# EAGLE design motor-driver (EAGLE 9.6.2)
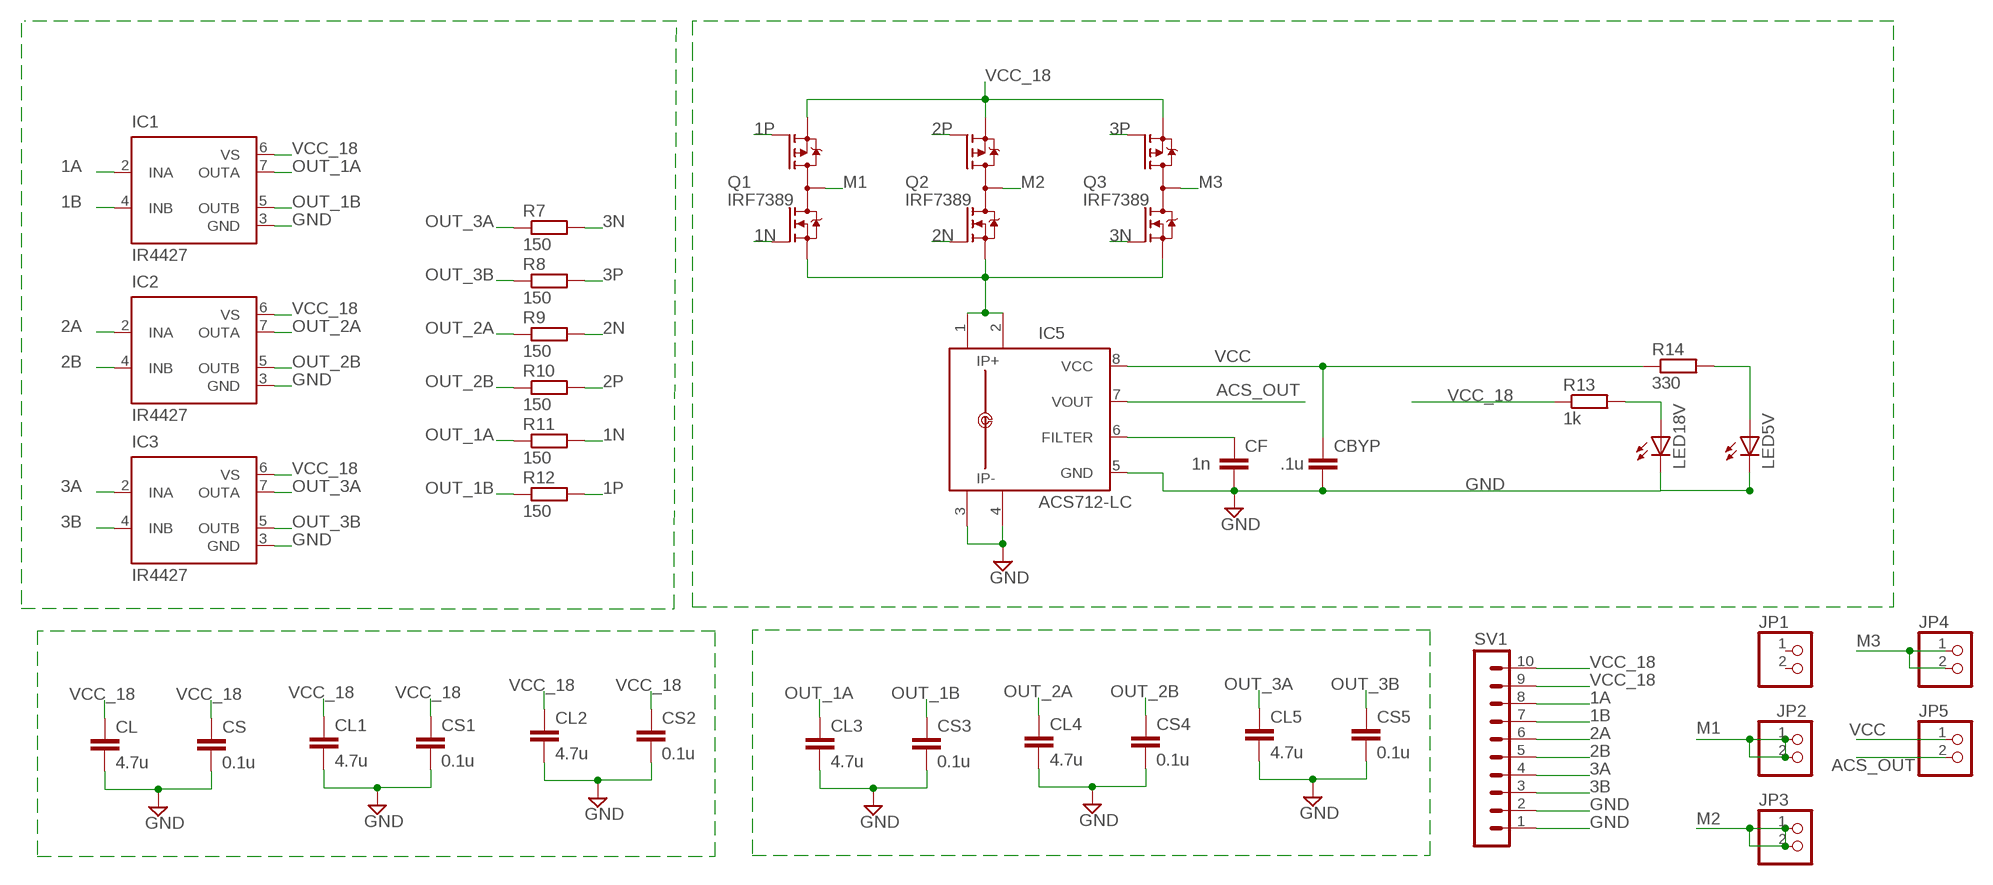
[diagram p0: schematic, sheet 1]

## Parts
CBYP  .1u  CC1206  [C1206]
CF  1n  CC1206  [C1206]
CL  4.7u  CC1206  [C1206]
CL1  4.7u  CC1206  [C1206]
CL2  4.7u  CC1206  [C1206]
CL3  4.7u  CC1206  [C1206]
CL4  4.7u  CC1206  [C1206]
CL5  4.7u  CC1206  [C1206]
CS  0.1u  CC1206  [C1206]
CS1  0.1u  CC1206  [C1206]
CS2  0.1u  CC1206  [C1206]
CS3  0.1u  CC1206  [C1206]
CS4  0.1u  CC1206  [C1206]
CS5  0.1u  CC1206  [C1206]
IC1  IR4427  [DIL08]
IC2  IR4427  [DIL08]
IC3  IR4427  [DIL08]
IC5  ACS712-LC  [SOIC8]
JP1  PINHD-1X2  [1X02]
JP2  PINHD-1X2  [1X02]
JP3  PINHD-1X2  [1X02]
JP4  PINHD-1X2  [1X02]
JP5  PINHD-1X2  [1X02]
LED5V  LEDCHIPLED_1206  [CHIPLED_1206]
LED18V  LEDCHIPLED_1206  [CHIPLED_1206]
Q1  IRF7389  [SO08-IRF]
Q2  IRF7389  [SO08-IRF]
Q3  IRF7389  [SO08-IRF]
R7  150  RR1206  [R1206]
R8  150  RR1206  [R1206]
R9  150  RR1206  [R1206]
R10  150  RR1206  [R1206]
R11  150  RR1206  [R1206]
R12  150  RR1206  [R1206]
R13  1k  RR1206  [R1206]
R14  330  RR1206  [R1206]
SV1  MA10-1  [MA10-1]

## Nets
1A: IC1.2(INA) SV1.8
1B: IC1.4(INB) SV1.7
1N: Q1.2(N-G) R11.2
1P: Q1.4(P-G) R12.2
2A: IC2.2(INA) SV1.6
2B: IC2.4(INB) SV1.5
2N: Q2.2(N-G) R9.2
2P: Q2.4(P-G) R10.2
3A: IC3.2(INA) SV1.4
3B: IC3.4(INB) SV1.3
3N: Q3.2(N-G) R7.2
3P: Q3.4(P-G) R8.2
ACS_OUT: IC5.7(VOUT) JP5.2
FILTER_ACS: CF.1 IC5.6(FILTER)
GND: CBYP.2 CF.2 CL1.2 CL2.2 CL3.2 CL4.2 CL5.2 CL.2 CS1.2 CS2.2 CS3.2 CS4.2 CS5.2 CS.2 IC1.3(GND) IC2.3(GND) IC3.3(GND) IC5.3(IP-) IC5.4(IP-1) IC5.5(GND) LED5V.C LED18V.C SV1.1 SV1.2
M1: JP2.1 JP2.2 Q1.5(D) Q1.6(D) Q1.7(D) Q1.8(D)
M2: JP3.1 JP3.2 Q2.5(D) Q2.6(D) Q2.7(D) Q2.8(D)
M3: JP4.1 JP4.2 Q3.5(D) Q3.6(D) Q3.7(D) Q3.8(D)
N$2: LED18V.A R13.2
N$4: LED5V.A R14.2
OUT_1A: CL3.1 IC1.7(OUTA) R11.1
OUT_1B: CS3.1 IC1.5(OUTB) R12.1
OUT_2A: CL4.1 IC2.7(OUTA) R9.1
OUT_2B: CS4.1 IC2.5(OUTB) R10.1
OUT_3A: CL5.1 IC3.7(OUTA) R7.1
OUT_3B: CS5.1 IC3.5(OUTB) R8.1
SINK: IC5.1(IP+) IC5.2(IP+1) Q1.1(N-S) Q2.1(N-S) Q3.1(N-S)
VCC: CBYP.1 IC5.8(VCC) JP5.1 R14.1
VCC_18: CL1.1 CL2.1 CL.1 CS1.1 CS2.1 CS.1 IC1.6(VS) IC2.6(VS) IC3.6(VS) Q1.3(P-S) Q2.3(P-S) Q3.3(P-S) R13.1 SV1.9 SV1.10
Unconnected: JP1.1 JP1.2

## Library data of the parts
CBYP CF CL CL1-CL5 CS CS1-CS5 = eagle-ltspice:C: CAPACITOR, European symbol; SPICEMODEL: NONE; SPICEPREFIX: C
IC1-IC3 = ir:IR4427: DUAL LOW SIDE DRIVER Source: ID4426.pdf; MF: INTERNATIONAL RECTIFIER(IR); MPN: IR4427; OC_FARNELL: 1023267; OC_NEWARK: 27C6914
IC5 = allegro-2:ACS712-LC
JP1-JP5 = pinhead:PINHD-1X2: PIN HEADER
LED5V LED18V = audio amplifier example:LED
Q1-Q3 = transistor-fet:IRF7389: Complimentary Half Bridge HEXFET Power MOSFET Source: http://www.irf.com/product-info/datasheets/data/irf7389.pdf
R7-R14 = eagle-ltspice:R: RESISTOR, European symbol; SPICEMODEL: NONE; SPICEPREFIX: R
SV1 = con-lstb:MA10-1: PIN HEADER; OC_FARNELL: unknown; OC_NEWARK: unknown

## Board
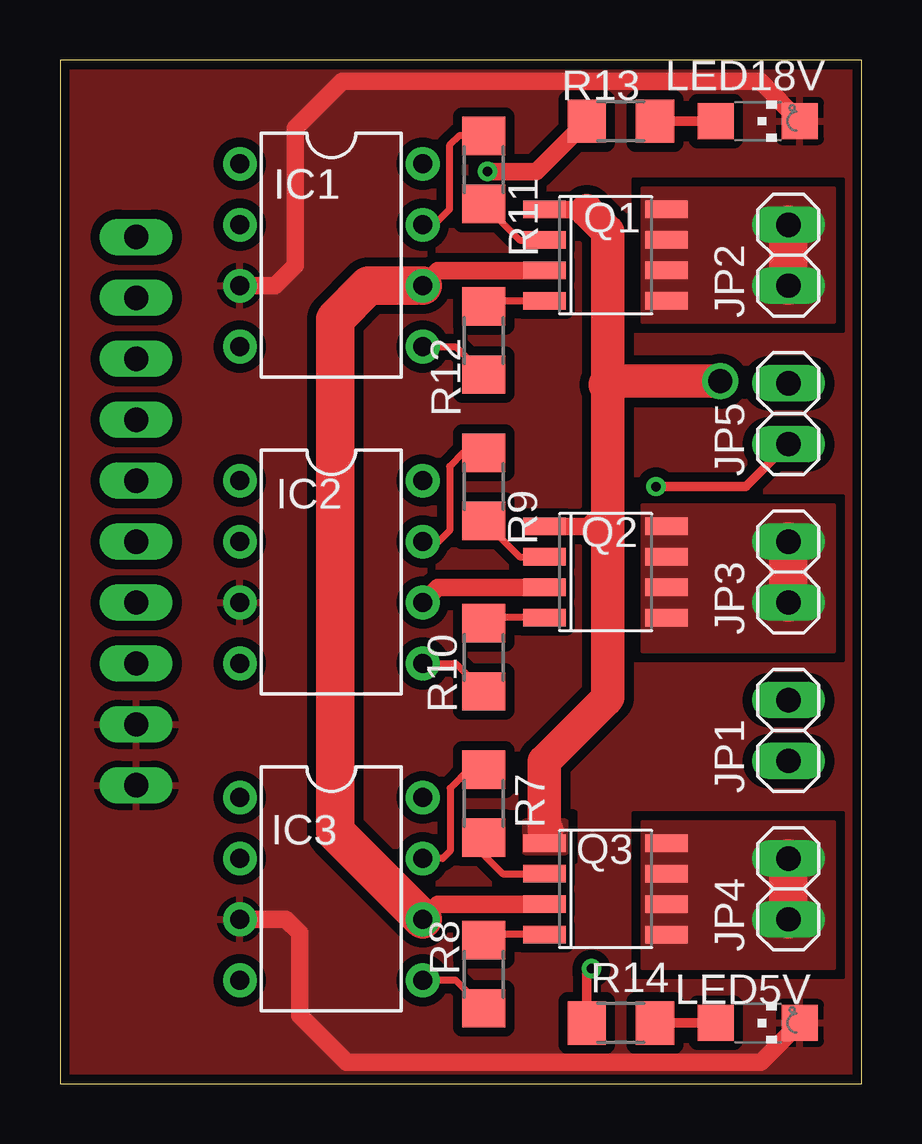
[diagram p1: board, top side]
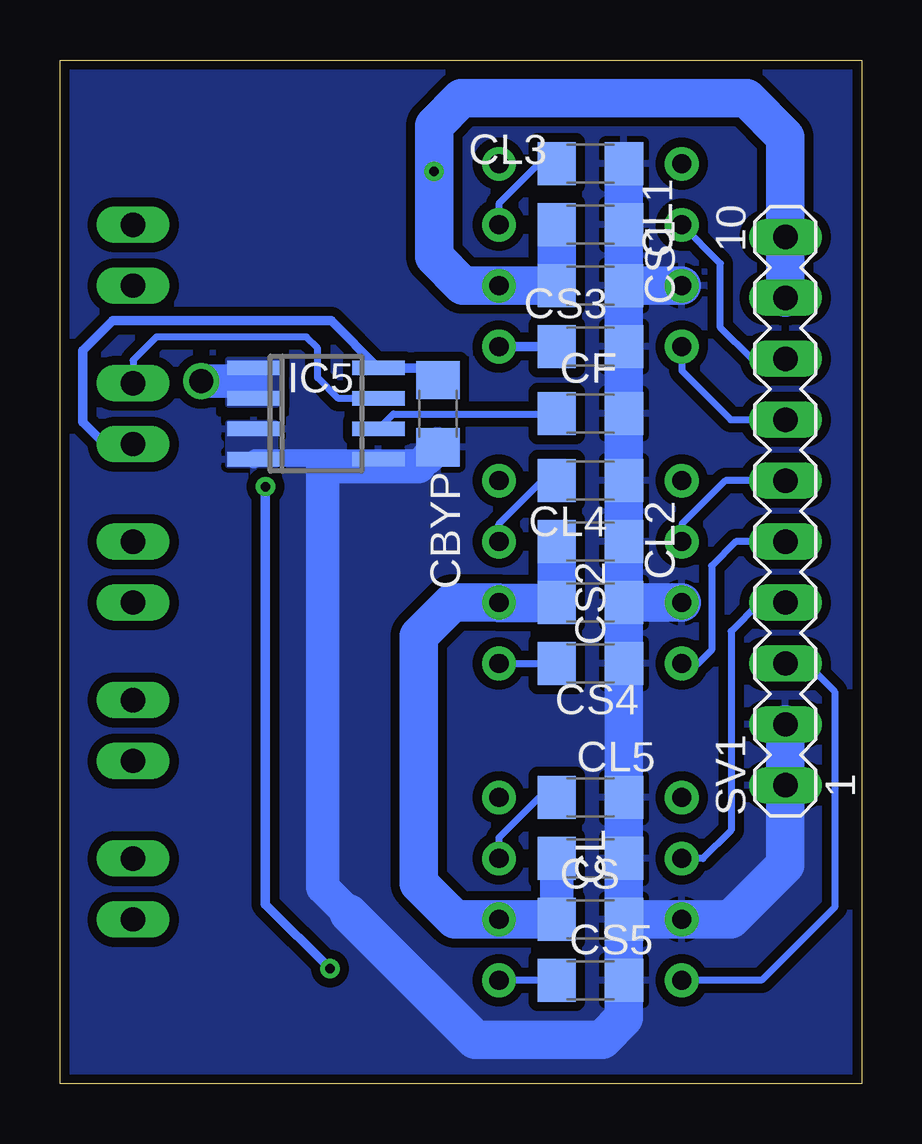
[diagram p2: board, bottom side, seen from below]

Size 33.4 x 42.67 mm. Coordinates in mm from the lower left corner, seen from the top.
Outline: 0,0 33.4,0 33.4,42.67 0,42.67 0,0
Copper layers (1*16): Top 0.035mm / dielectric 1.5mm / Bottom 0.035mm
Design rules "default *": minimum track width 6mil, minimum drill 0.35mm, track to track 6mil, track to pad 6mil, pad to pad 6mil, via to via 6mil, smd to smd 6mil, copper to edge 0.3mm, drill to drill 6mil, minimum pad ring 10mil, minimum via ring 8mil, stop-mask expansion 4mil, vias tented up to drill 0mil, thermal gap 10mil

### Footprints (pad centres in the part's own frame; a part is rotated, then mirrored left to right if it is on the bottom)
C1206 = smd 1.6 x 1.8: 1 -1.4,0; 2 1.4,0
DIL08 = drill 0.8 pad 1.4: 1 -3.81,-3.81; 2 -1.27,-3.81; 3 1.27,-3.81; 4 3.81,-3.81; 5 3.81,3.81; 6 1.27,3.81; 7 -1.27,3.81; 8 -3.81,3.81
SOIC8 = smd 0.6 x 2.2: 1 -1.905,-2.6; 2 -0.635,-2.6; 3 0.635,-2.6; 4 1.905,-2.6; 5 1.905,2.6; 6 0.635,2.6; 7 -0.635,2.6; 8 -1.905,2.6
1X02 = drill 1.016 long: 1 -1.27,0; 2 1.27,0
CHIPLED_1206 = smd 1.5 x 1.5: A 0,-1.75; C 0,1.75
SO08-IRF = smd 0.72 x 1.78: 1 -1.905,-2.543; 2 -0.635,-2.543; 3 0.635,-2.543; 4 1.905,-2.543; 5 1.905,2.543; 6 0.635,2.543; 7 -0.635,2.543; 8 -1.905,2.543
R1206 = smd 1.6 x 1.803: 1 -1.422,0; 2 1.422,0
MA10-1 = drill 1.016 long: 1 -11.43,0; 2 -8.89,0; 3 -6.35,0; 4 -3.81,0; 5 -1.27,0; 6 1.27,0; 7 3.81,0; 8 6.35,0; 9 8.89,0; 10 11.43,0

### Placement (x,y rotation side)
CBYP  17.65,27.94 270 bottom
CF  11.3,27.94 0 bottom
CL  11.3,9.4 0 bottom
CL1  11.3,35.81 0 bottom
CL2  11.3,22.61 0 bottom
CL3  11.3,38.35 0 bottom
CL4  11.3,25.15 0 bottom
CL5  11.3,11.94 0 bottom
CS  11.3,6.86 0 bottom
CS1  11.3,33.27 0 bottom
CS2  11.3,20.07 0 bottom
CS3  11.3,30.73 0 bottom
CS4  11.3,17.53 0 bottom
CS5  11.3,4.32 0 bottom
IC1  11.3,34.54 270 top
IC2  11.3,21.34 270 top
IC3  11.3,8.13 270 top
IC5  22.73,27.94 270 bottom
JP1  30.35,14.73 90 top
JP2  30.35,34.54 90 top
JP3  30.35,21.34 90 top
JP4  30.35,8.13 90 top
JP5  30.35,27.94 90 top
LED5V  29.08,2.54 270 top
LED18V  29.08,40.13 270 top
Q1  22.73,34.54 270 top
Q2  22.73,21.34 270 top
Q3  22.73,8.13 270 top
R7  17.65,11.68 270 top
R8  17.65,4.57 90 top
R9  17.65,24.89 270 top
R10  17.65,17.78 90 top
R11  17.65,38.1 270 top
R12  17.65,30.99 90 top
R13  23.37,40.13 0 top
R14  23.37,2.54 0 top
SV1  3.17,23.88 90 bottom

### Tracks (layer width: path | path; a pad name or v marks a point on that pad's centre or on a via)
1A
  Bottom 0.3: SV1.8 4.58,30.23 5.88,31.53 5.88,34.2 IC1.2
1B
  Bottom 0.3: IC1.4 7.49,29.72 5.45,27.69 SV1.7
1N
  Top 0.3: R11.2 19.15,35.18 Q1.2
1P
  Top 0.3: Q1.4 17.88,32.64 R12.2
2A
  Bottom 0.3: SV1.6 5.68,25.15 7.49,23.33 IC2.2
2B
  Bottom 0.3: SV1.5 5.24,22.61 6.25,21.59 6.25,18.08 6.81,17.53 IC2.4
2N
  Top 0.3: R9.2 19.15,21.97 Q2.2
2P
  Top 0.3: Q2.4 17.89,19.44 R10.2
3A
  Bottom 0.3: IC3.2 6.62,9.4 5.44,10.57 5.44,18.87 4.24,20.07 SV1.4
3B
  Bottom 0.3: SV1.3 2.3,17.53 1.12,16.35 1.12,7.36 4.16,4.32 IC3.4
3N
  Top 0.3: R7.2 17.65,9.55 18.44,8.76 Q3.2
3P
  Top 0.3: Q3.4 20.18,6.23 17.89,6.23 R8.2
ACS_OUT
  Bottom 0.3: IC5.7 21.8,28.57 22.67,29.44 22.67,30.67 23.14,31.14 29.38,31.14 30.35,30.17 JP5.2
FILTER_ACS
  Bottom 0.3: IC5.6 19.52,27.92 12.72,27.92
  Bottom 0.4: 12.72,27.92 CF.1
GND
  Top 0.725: LED5V.C 29.19,0.89 11.95,0.89 9.99,2.86 9.99,6.29 9.41,6.86 IC3.3 | LED18V.C 29.17,41.8 11.76,41.8 9.8,39.84 9.8,34.12 8.96,33.27 IC1.3
  Bottom 0.725: IC5.4 25.28,26.09 20.1,26.09 | 18.1,26.09 20.08,26.09
  Bottom 1.4: 8.56,6.86 9.73,6.86 9.9,7.03 | IC2.3 9.88,20.07 | IC1.3 9.78,33.27 9.9,33.4 | 18.45,25.74 22.45,25.74 22.45,8.19 21.38,7.12 | CBYP.2 18.1,26.09
  Bottom 1.6: 21.38,7.12 16.09,1.83 10.81,1.83 9.9,2.75 CS5.2 9.9,6.69 9.73,6.86 | 9.88,20.07 9.9,20.04 CS4.2 CL5.2 CL.2 CS.2 8.56,6.86 IC3.3 5.45,6.86 3.17,9.13 SV1.1 SV1.2 | CS1.2 CS3.2 CF.2 CL4.2 CL2.2 CS2.2 IC2.3 | CS1.2 CL1.2 CL3.2 | CS1.2 IC1.3
  pour Bottom (no thermals): 24.4,27.54 26.4,27.54 26.4,25.79 24.4,25.79
  pour Bottom (isolate 0.381, rank 2): 0,42.67 33.4,42.67 33.4,0 0,0
  pour Top (isolate 0.381, rank 2): 0,42.67 33.4,42.67 33.4,0 0,0
M1
  Top 1.6: JP2.2 JP2.1
  pour Top (no thermals): 24.26,37.34 32.26,37.34 32.26,31.75 24.26,31.75
M2
  Top 1.6: JP3.2 JP3.1
  pour Top (no thermals): 24.26,24.13 32.26,24.13 32.26,18.03 24.26,18.03
M3
  Top 1.6: JP4.2 JP4.1
  pour Top (no thermals): 24.26,10.92 32.26,10.92 32.26,4.83 24.26,4.83
N$2
  Top 0.4: R13.2 LED18V.A
N$4
  Top 0.4: R14.2 LED5V.A
OUT_1A
  Top 0.3: R11.1 16.62,39.52 16.23,39.12 16.23,36.45 15.6,35.81 IC1.7
  Bottom 0.3: CL3.1 13.45,38.35 15.11,36.69 IC1.7
OUT_1B
  Top 0.3: IC1.5 16.48,30.73 R12.1
  Bottom 0.4: CS3.1 IC1.5
OUT_2A
  Top 0.3: R9.1 16.8,26.31 16.23,25.74 16.23,23.07 15.77,22.61 IC2.7
  Bottom 0.3: IC2.7 15.11,23.33 13.3,25.15 CL4.1
OUT_2B
  Top 0.3: IC2.5 16.48,17.53 R10.1
  Bottom 0.3: IC2.5 CS4.1
OUT_3A
  Top 0.3: IC3.7 15.94,9.4 16.25,9.71 16.25,12.33 17.03,13.11 R7.1
  Bottom 0.3: CL5.1 13.44,11.94 15.11,10.26 IC3.7
OUT_3B
  Top 0.3: R8.1 16.48,4.32 IC3.5
  Bottom 0.3: CS5.1 IC3.5
SINK  (via drill 1)
  Top 0.725: Q2.1 22,23.24 | 22.83,16.1 22.73,16 | Q1.1 21.9,36.45 21.95,36.4
  Top 0.75: 22.83,24.47 22.83,24.07 22,23.24 22.83,22.41
  Top 1.4: 22.73,16 20.17,13.45 20.17,10.59 20.27,10.59 | 22.83,16.1 22.83,22.41 22.83,22.42 22.83,24.47 22.83,29.14 22.83,29.29 | 22.83,29.29 22.83,35.52 21.95,36.4 | 22.83,29.29 v27.52,29.29
  Top 1.6: 23.02,29.33 22.83,29.14
  Bottom 1.4: v27.52,29.29 25.25,29.29 25.25,29.31
  pour Bottom (no thermals): 24.35,30.17 26.4,30.17 26.4,28.33 24.35,28.33
  pour Top (no thermals): 19.38,9.68 21.06,9.68 21.06,10.39 21.06,10.92 20.02,10.92 19.38,10.92
VCC  (via drill 0.4)
  Top 0.4: JP5.1 28.58,24.9 v24.84,24.9 | v22.15,4.8 21.95,4.6 R14.1
  Bottom 0.4: CBYP.1 18.16,29.85 IC5.8 22.1,31.81 31.2,31.81 32.45,30.56 32.45,27.58 31.53,26.67 JP5.1 | v24.84,24.9 24.84,7.49 v22.15,4.8
VCC_18  (via drill 0.4)
  Top 0.725: Q2.3 15.75,20.7 IC2.6 | IC3.6 15.75,7.49 Q3.3 | Q1.3 15.75,33.91 IC1.6 | R13.1 19.85,38.03 v17.82,38.03
  Top 1.6: IC3.6 11.46,10.51 11.46,31.89 12.85,33.27 IC1.6
  Bottom 0.725: 12.72,20.05 CS2.1
  Bottom 1.4: CL.1 CS.1
  Bottom 1.6: SV1.9 SV1.10 3.17,39.46 4.79,41.08 16.68,41.08 17.82,39.94 v17.82,38.03 17.82,34.48 16.61,33.27 IC1.6 CS1.1 CL1.1 | CS.1 IC3.6 16.95,6.86 18.45,8.36 18.45,18.67 17.05,20.07 IC2.6 15.09,20.05 12.72,20.05 | CS2.1 CL2.1